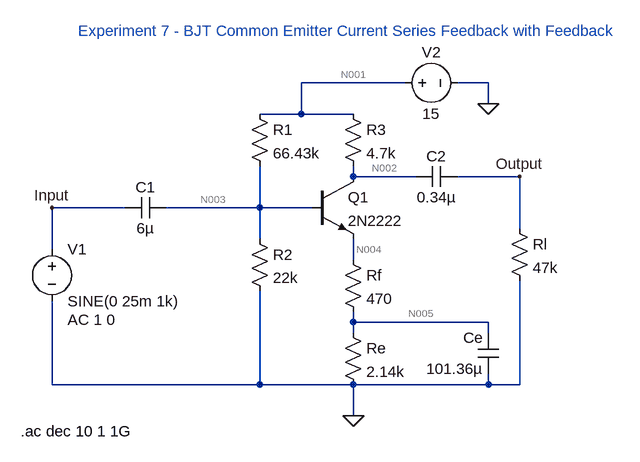
[diagram p0: schematic Experiment 7 - BJT Common Emitter Current Series Feedback with Feedback.asc]
Experiment 7 - BJT Common Emitter Current Series Feedback with Feedback.asc, the LTspice schematic file:
Version 4
SHEET 1 880 680
WIRE 96 48 -64 48
WIRE 224 48 176 48
WIRE 224 80 224 48
WIRE -64 96 -64 48
WIRE -64 96 -128 96
WIRE 16 96 -64 96
WIRE 16 192 16 176
WIRE 112 192 16 192
WIRE 272 192 176 192
WIRE -336 240 -448 240
WIRE -128 240 -128 176
WIRE -128 240 -272 240
WIRE -48 240 -128 240
WIRE 272 272 272 192
WIRE -128 288 -128 240
WIRE -448 304 -448 240
WIRE 16 320 16 288
WIRE 16 416 16 400
WIRE 224 416 16 416
WIRE 16 432 16 416
WIRE 224 432 224 416
WIRE -448 512 -448 384
WIRE -128 512 -128 368
WIRE -128 512 -448 512
WIRE 16 512 -128 512
WIRE 224 512 224 496
WIRE 224 512 16 512
WIRE 272 512 272 352
WIRE 272 512 224 512
WIRE 16 560 16 512
FLAG 224 80 0
FLAG 16 560 0
FLAG 272 192 Output
FLAG -448 240 Input
SYMBOL voltage -448 288 R0
WINDOW 123 24 124 Left 2
WINDOW 39 0 0 Left 0
SYMATTR InstName V1
SYMATTR Value SINE(0 25m 1k)
SYMATTR Value2 AC 1 0
SYMBOL cap -272 224 R90
WINDOW 0 0 32 VBottom 2
WINDOW 3 32 32 VTop 2
SYMATTR InstName C1
SYMATTR Value 6µ
SYMBOL voltage 80 48 R270
WINDOW 0 32 56 VTop 2
WINDOW 3 -32 56 VBottom 2
WINDOW 123 0 0 Left 0
WINDOW 39 0 0 Left 0
SYMATTR InstName V2
SYMATTR Value 15
SYMBOL res -144 80 R0
SYMATTR InstName R1
SYMATTR Value 66.43k
SYMBOL res -144 272 R0
SYMATTR InstName R2
SYMATTR Value 22k
SYMBOL res 0 80 R0
SYMATTR InstName R3
SYMATTR Value 4.7k
SYMBOL npn -48 192 R0
SYMATTR InstName Q1
SYMATTR Value 2N2222
SYMBOL cap 176 176 R90
WINDOW 0 0 32 VBottom 2
WINDOW 3 32 32 VTop 2
SYMATTR InstName C2
SYMATTR Value 0.34µ
SYMBOL cap 240 496 R180
WINDOW 0 24 56 Left 2
WINDOW 3 24 8 Left 2
SYMATTR InstName Ce
SYMATTR Value 101.36µ
SYMBOL res 0 304 R0
SYMATTR InstName Rf
SYMATTR Value 470
SYMBOL res 0 416 R0
SYMATTR InstName Re
SYMATTR Value 2.14k
SYMBOL res 256 256 R0
SYMATTR InstName Rl
SYMATTR Value 47k
TEXT -408 -32 Left 2 ;Experiment 7 - BJT Common Emitter Current Series Feedback with Feedback
TEXT -496 584 Left 2 !.ac dec 10 1 1G

The netlist it stands for:
* Experiment 7 - BJT Common Emitter Current Series Feedback with Feedback.asc
V1 Input 0 SINE(0 25m 1k) AC 1 0
C1 N003 Input 6µ
V2 N001 0 15
R1 N001 N003 66.43k
R2 N003 0 22k
R3 N001 N002 4.7k
Q1 N002 N003 N004 0 2N2222
C2 Output N002 0.34µ
Ce 0 N005 101.36µ
Rf N004 N005 470
Re N005 0 2.14k
Rl Output 0 47k
.model NPN NPN
.model PNP PNP
.lib standard.bjt
* Experiment 7 - BJT Common Emitter Current Series Feedback with Feedback
.ac dec 10 1 1G
.backanno
.end

* Results of the author's LTspice run, read from the files saved beside the schematic
* Operating Point, zero values left out:
*   V(n003) = 3.643 V
*   V(n001) = 15 V
*   V(n002) = 9.649 V
*   V(n004) = 2.985 V
*   V(n005) = 2.448 V
*   Ic(Q1) = 1.138 mA
*   Ib(Q1) = 5.389 µA
*   Ie(Q1) = -1.144 mA
*   I(Re) = 1.144 mA
*   I(Rf) = 1.144 mA
*   I(R3) = 1.138 mA
*   I(R2) = 165.6 µA
*   I(R1) = 171 µA
*   I(V2) = -1.309 mA
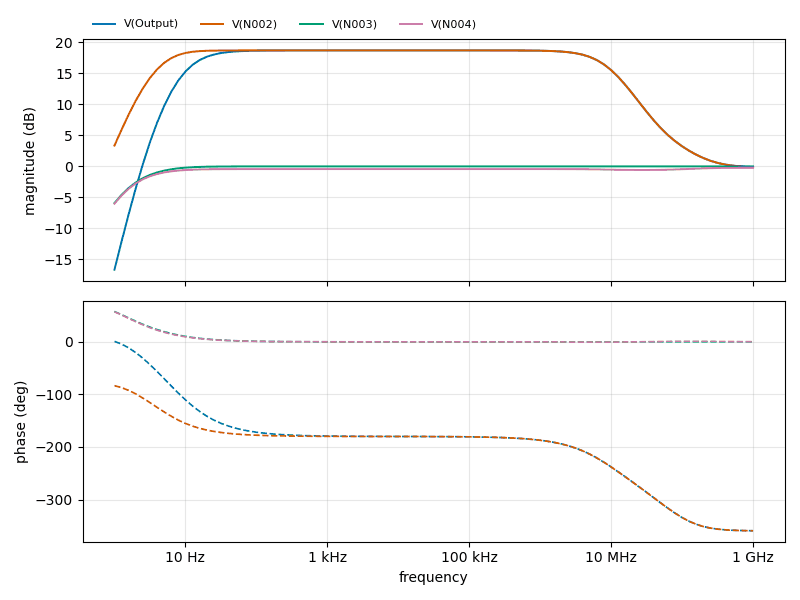
[diagram p1: AC Analysis of Experiment 7 - BJT Common Emitter Current Series Feedback with Feedback.asc, plotted from the saved traces]
* AC Analysis, 1 run:
*   V(Output): -16.65 dB at 1 Hz, -0.11 dB at 1 GHz, peak 18.69 dB at 10 kHz, 3 dB below the peak at 10.88 Hz and 9.588 MHz
*   V(N002): 3.35 dB at 1 Hz, -0.11 dB at 1 GHz, peak 18.69 dB at 3.981 kHz, 3 dB below the peak at 4.028 Hz and 9.588 MHz
*   V(N003): -5.90 dB at 1 Hz, -0.00 dB at 1 GHz, peak -0.00 dB at 1 GHz, 3 dB below the peak at 1.791 Hz
*   V(N004): -6.01 dB at 1 Hz, -0.21 dB at 1 GHz, peak -0.21 dB at 1 GHz, 3 dB below the peak at 1.758 Hz